# Altium schematic sheet FE2.1.SchDoc
size A4
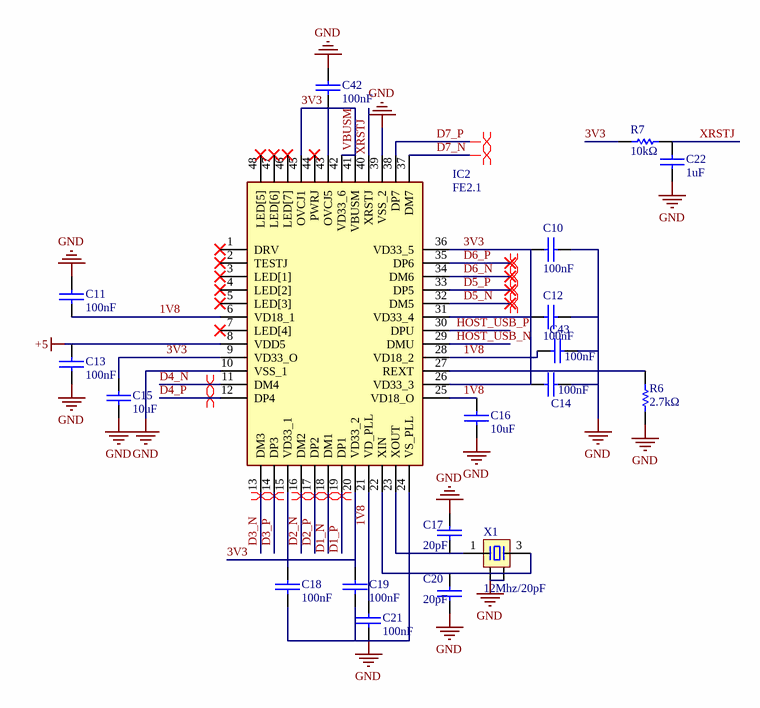
[diagram p0: FE2.1.SchDoc]

## Parts
C10  100nF  [C_0402]
C11  100nF  [C_0402]
C12  100nF  [C_0402]
C13  100nF  [C_0402]
C14  100nF  [C_0402]
C15  10uF  [C_0603]
C16  10uF  [C_0603]
C17  20pF  [C_0402]
C18  100nF  [C_0402]
C19  100nF  [C_0402]
C20  20pF  [C_0402]
C21  100nF  [C_0402]
C22  1uF  [C_0402]
C42  100nF  [C_0402]
C43  100nF  [C_0402]
IC2  FE2.1  [LQFP48-48_7x7]
R6  2.7kΩ  [R_0402]
R7  10kΩ  [R_0402]
X1  12Mhz/20pF  [XTAL_3225-4P]

## Nets
+5: C13.1 IC2.8(VDD5)
GND: C10.2 C11.1 C12.1 C13.2 C14.1 C15.1 C16.2 C17.2 C18.2 C19.2 C20.1 C21.2 C22.1 C42.2 C43.1 IC2.10(VSS_1) IC2.24(VS_PLL) IC2.39(VSS_2) R6.1 X1.2 X1.4
1V8: C11.2 C16.1 C21.1 C43.2 IC2.6(VD18_1) IC2.21(VD_PLL) IC2.25(VD18_O) IC2.28(VD18_2)
3V3: C10.1 C12.2 C14.2 C15.2 C18.1 C19.1 C42.1 IC2.9(VD33_O) IC2.15(VD33_1) IC2.20(VD33_2) IC2.26(VD33_3) IC2.31(VD33_4) IC2.36(VD33_5) IC2.41(VBUSM) IC2.42(VD33_6) IC2.43(OVCJ5) IC2.45(OVCJ1) R7.2  [also labelled VBUSM]
D1_N: IC2.18(DM1)
D1_P: IC2.19(DP1)
D2_N: IC2.16(DM2)
D2_P: IC2.17(DP2)
D3_N: IC2.13(DM3)
D3_P: IC2.14(DP3)
D4_N: IC2.11(DM4)
D4_P: IC2.12(DP4)
D5_N: IC2.32(DM5)
D5_P: IC2.33(DP5)
D6_N: IC2.34(DM6)
D6_P: IC2.35(DP6)
D7_N: IC2.37(DM7)
D7_P: IC2.38(DP7)
HOST_USB_N: IC2.29(DMU)
HOST_USB_P: IC2.30(DPU)
XRSTJ: C22.2 IC2.40(XRSTJ) R7.1
NetC17_1: C17.1 IC2.23(XOUT) X1.1
NetC20_2: C20.2 IC2.22(XIN) X1.3
NetIC2_27: IC2.27(REXT) R6.2

Not connected (* = marked no-connect by the designer): IC2 1(DRV)* 2(TESTJ)* 3(LED[1])* 4(LED[2])* 5(LED[3])* 7(LED[4])* 44(PWRJ)* 46(LED[7])* 47(LED[6])* 48(LED[5])*

## Layout directives
differential pair: D1_N, D1_P, D2_N, D2_P, D3_N, D3_P, D4_N, D4_P, D5_N, D5_P, D6_N, D6_P, D7_N, D7_P

## Library data of the parts
C10-C22 C42 C43 = Cap_Chip: 贴片电容; Manufacturer_Name: *; Manufacturer_Part_Number: *
IC2 = FE2.1_QFP: USB2.0 Hub 芯片; Manufacturer_Name: Terminus Technology; Manufacturer_Part_Number: FE2.1_QFP; LCSC: C39693
R6 R7 = Res_Chip: 贴片电阻; Manufacturer_Name: *; Manufacturer_Part_Number: *
X1 = Crystal_4P: 4脚无源晶振; Manufacturer_Name: YXC(扬兴科技); Manufacturer_Part_Number: X322512MSB4SI; LCSC: C9002